# Altium project IR_SCOOTER.PrjPcb (part 3 of 4)

## Sheet IR_COMMUNICATION.SchDoc: IR_COMMUNICATION
size 420 x 297 mm; Engineer: ALPER KORKMAZ; SheetNumber: 6; SheetTotal: 8; SHEET: 6
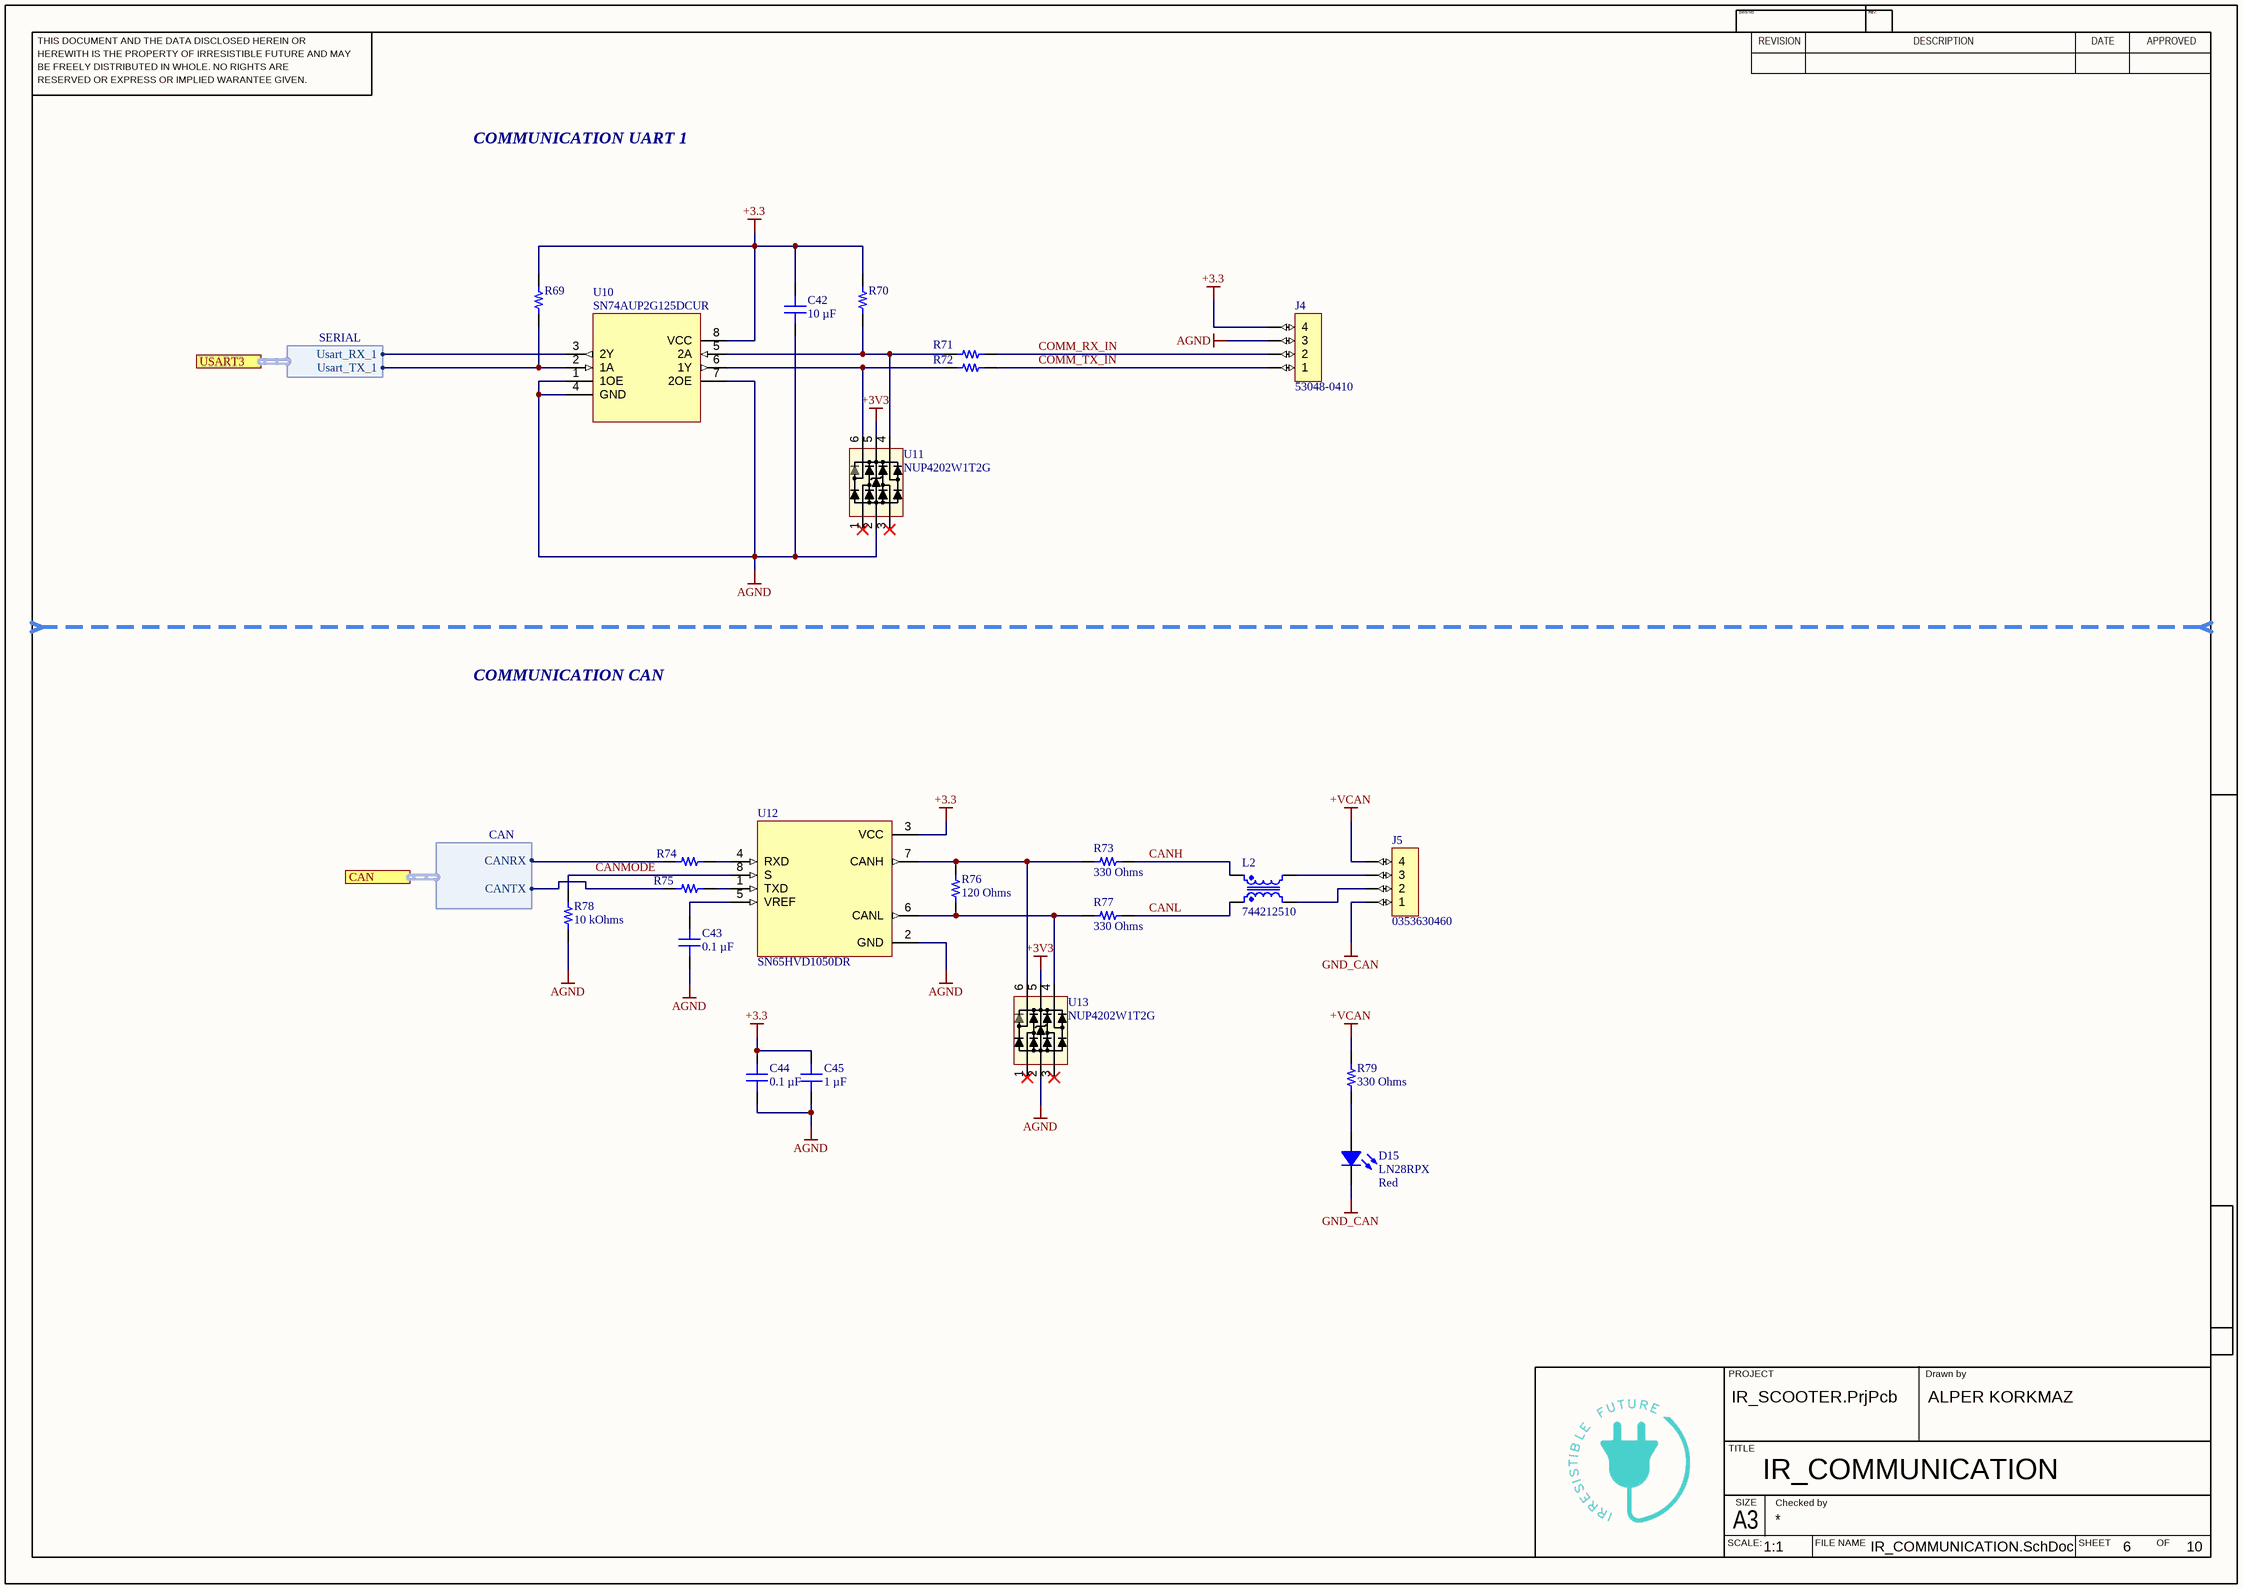
[diagram p5: IR_COMMUNICATION.SchDoc]

### Parts
(Parts that share a designator on the sheet are numbered #1, #2 ... from top to bottom, then left to right.)
C42  10 µF  [CAP 0603_1608]
C43  0.1 µF  [CAP 0603_1608]
C44  0.1 µF  [CAP 0603_1608]
C45  1 µF  [CAP 0603_1608]
D15  LN28RPX  Lens Color: Red  [Led-3mm-Red-h7]
J4#1  53048-0410  [CONN_4_POS__0530480410]
J5#1  0353630460  [CONN_4_POS__0353630460]
L2  744212510  [CM_6.50mm x 3.60mm]
R69  100 kOhms  [RES 0603_1608]  (value not drawn)
R70  100 kOhms  [RES 0603_1608]  (value not drawn)
R71  22 Ohms  [RES 0603_1608]  (value not drawn)
R72  22 Ohms  [RES 0603_1608]  (value not drawn)
R73  330 Ohms  [RES 0603_1608]
R74  22 Ohms  [RES 0603_1608]  (value not drawn)
R75  22 Ohms  [RES 0603_1608]  (value not drawn)
R76  120 Ohms  [RES 0603_1608]
R77  330 Ohms  [RES 0603_1608]
R78  10 kOhms  [RES 0603_1608]
R79  330 Ohms  [RES 0603_1608]
U10  SN74AUP2G125DCUR  [VFSOP_8]
U11  NUP4202W1T2G  [SOT-363]
U12  SN65HVD1050DR  [SOIC-8_L]
U13  NUP4202W1T2G  [SOT-363]

### Ports
CAN (harness CAN, see 1[1B], 3[5B]), USART3 (harness SERIAL, see 1[1B], 3[5B])

### Harnesses
SERIAL: Usart_RX_1, Usart_TX_1
CAN: CANRX, CANTX

### Nets
+3.3: C42.2 C44.2 C45.2 J4#1.4 R69.2 R70.2 U10.8(VCC) U12.3(VCC)
+3V3: U11.5 U13.5
+VCAN: J5#1.4 R79.2
AGND: C42.1 C43.1 C44.1 C45.1 J4#1.3 R78.1 U10.1(1OE) U10.4(GND) U10.7(2OE) U11.2 U12.2(GND) U13.2
GND_CAN: D15.2(K) J5#1.1
CANH: L2.3 R73.2
CANL: L2.1 R77.2
CANMODE: R78.2 U12.8(S)
COMM_RX_IN: J4#1.2 R71.2
COMM_TX_IN: J4#1.1 R72.2
NetC43_2: C43.2 U12.5(VREF)
NetD15_1: D15.1(A) R79.1
NetJ5#1_2: J5#1.2 L2.5
NetJ5#1_3: J5#1.3 L2.4
NetR69_1: R69.1 U10.2(1A) ; port USART3.Usart_TX_1
NetR70_1: R70.1 R71.1 U10.5(2A) U11.4
NetR72_1: R72.1 U10.6(1Y) U11.6
NetR73_1: R73.1 R76.2 U12.7(CANH) U13.6
NetR74_1: R74.1 ; port CAN.CANRX
NetR74_2: R74.2 U12.4(RXD)
NetR75_1: R75.1 ; port CAN.CANTX
NetR75_2: R75.2 U12.1(TXD)
NetR76_1: R76.1 R77.1 U12.6(CANL) U13.4
NetU4_22: U10.3(2Y) ; port USART3.Usart_RX_1

Not connected (* = marked no-connect by the designer): U11 1* 3*; U13 1* 3*

### Notes on the sheet
- COMMUNICATION UART 1
- COMMUNICATION CAN
- THIS DOCUMENT AND THE DATA DISCLOSED HEREIN OR
- HEREWITH IS THE PROPERTY OF IRRESISTIBLE FUTURE AND MAY
- DWG NO:
- REVISION
- REV:
- DESCRIPTION
- DATE
- APPROVED
- BE FREELY DISTRIBUTED IN WHOLE. NO RIGHTS ARE
- RESERVED OR EXPRESS OR IMPLIED WARANTEE GIVEN.
- PROJECT
- Drawn by
- TITLE
- SCALE:
- A3
- SIZE
- Checked by
- FILE NAME
- SHEET
- OF
- 1:1
- 10

### Library data of the parts
C42 = GRM188R60J106ME47D: CAP CER 10UF 6.3V X5R 0603; manufacturer: Murata Electronics; Tolerance: ±20%; Part Number: GRM188R60J106ME47D; Value: 10 µF; Applications: General Purpose; Capacitance: 10 µF; componentlink1description: Datasheet; componentlink1url: https://www.murata.com/~/media/webrenewal/support/library/catalog/products/capacitor/mlcc/c02e.ashx?la=en-us; componentlink2description: DigiKey Link; componentlink2url: https://www.digikey.com/en/products/detail/murata-electronics/GRM188R60J106ME47D/965910; Device Package: 0603 (1608 Metric); lastupdated: 13.07.2022 13:47:07; Lifecycle Status: Active; Minimum Order: 1; Mounting Type: Surface Mount, MLCC; Operating Temperature: -55°C ~ 85°C; Package / Case: 0603 (1608 Metric); packaging: TapeAndReel; partid: 2351; Part Status: Active; price: 0.03; series: GRM; Size / Dimension: 0.063" L x 0.031" W (1.60mm x 0.80mm); Supplier 1: DigiKey; Supplier Part Number 1: 490-3896-1-ND; Temperature Coefficient: X5R; Thickness (Max): 0.035" (0.90mm); Voltage - Rated: 6.3V
C43 C44 = C0603C104K5RECAUTO: CAP CER 0.10UF 50V X7R 0603; manufacturer: KEMET; Tolerance: ±10%; Part Number: C0603C104K5RECAUTO; Value: 0.1 µF; Applications: Automotive, ESD Protection; Capacitance: 0.1 µF; componentlink1description: Datasheet; componentlink1url: https://api.kemet.com/component-edge/download/datasheet/C0603C104K5RECAUTO.pdf; componentlink2description: DigiKey Link; componentlink2url: https://www.digikey.com/en/products/detail/kemet/C0603C104K5RECAUTO/6575893; Device Package: 0603 (1608 Metric); lastupdated: 13.07.2022 13:46:58; Lifecycle Status: Active; Minimum Order: 1; Mounting Type: Surface Mount, MLCC; Operating Temperature: -55°C ~ 125°C; Package / Case: 0603 (1608 Metric); packaging: TapeAndReel; partid: 6683; Part Status: Active; price: 0.04; Ratings: AEC-Q200; series: ESD SMD Auto X7R; Size / Dimension: 0.063" L x 0.031" W (1.60mm x 0.80mm); Supplier 1: DigiKey; Supplier Part Number 1: 399-14105-1-ND; Temperature Coefficient: X7R; Thickness (Max): 0.034" (0.87mm); Voltage - Rated: 50V
C45 = C0603C105K4RACAUTO: CAP CER 1UF 16V X7R 0603; manufacturer: KEMET; Tolerance: ±10%; Part Number: C0603C105K4RACAUTO; Value: 1 µF; Applications: Automotive, Bypass, Decoupling; Capacitance: 1 µF; componentlink1description: Datasheet; componentlink1url: https://api.kemet.com/component-edge/download/datasheet/C0603C105K4RACAUTO.pdf; componentlink2description: DigiKey Link; componentlink2url: https://www.digikey.com/en/products/detail/kemet/C0603C105K4RACAUTO/8635831; Device Package: 0603 (1608 Metric); lastupdated: 13.07.2022 13:47:07; Lifecycle Status: Active; Minimum Order: 1; Mounting Type: Surface Mount, MLCC; Operating Temperature: -55°C ~ 125°C; Package / Case: 0603 (1608 Metric); packaging: TapeAndReel; partid: 2179; Part Status: Active; price: 0.02; Ratings: AEC-Q200; series: SMD Auto X7R; Size / Dimension: 0.063" L x 0.031" W (1.60mm x 0.80mm); Supplier 1: DigiKey; Supplier Part Number 1: 399-17704-1-ND; Temperature Coefficient: X7R; Thickness (Max): 0.037" (0.95mm); Voltage - Rated: 16V
D15 = LED_RED__LN28RPX: LED RED DIFF 3MM ROUND T/H; Manufacturer: Panasonic Electronic Components; Lens Transparency: Diffused; Millicandela Rating: 2.8mcd; Lens Style/Size: Round with Domed Top, 3mm (T-1), 3.00mm; Voltage - Forward (Vf) (Typ): 2.2V; Current - Test: 15mA; Wavelength - Peak: 700nm; Manufacturer Part Number: LN28RPX; Category: Optoelectronics; Supplier: Digi-Key; RoHS: RoHS Compliant; Packaging: Bulk; Part Status: Not For New Designs; Color: Red; Viewing Angle: -; Mounting Type: Through Hole; Wavelength - Dominant: -; Features: -; Package / Case: Radial; Supplier Device Package: 3mm Round; Size / Dimension: -; Height (Max): 5.70mm; ComponentLink1URL: http://industrial.panasonic.com/www-cgi/jvcr13pz.cgi?E+SC+4+ATA7001+LN28RPX+8+WW; ComponentLink1Description: http://industrial.panasonic.com/www-cgi/jvcr13pz.cgi?E+SC+4+ATA7001+LN28RPX+8+WW; Pricing: 1=0.45, 10=0.326, 25=0.2664, 100=0.213, 250=0.17972, 500=0.15308, 1000=0.11981, 2500=0.10982, 5000=0.09984 (USD); Supplier Part Number: P563-ND
J4#1 = CONN_4_POS__0530480410: CONN HEADER R/A 4POS 1.25MM; Manufacturer: Molex; Contact Resistance: 20mR; Current Rating: 1A; Voltage Rating: 125V; Number of Positions: 4; Insulation Resistance: 100MR; Gender: Male; Connector Type: Blade Pin; Glow Wire Compliant: Non-compliant; Supplier 1: Avnet; Manufacturer Part Number: 53048-0410; Stock 1: 44; Pricing 1: 1=0.1232 (USD); Mount: Through Hole; Case/Package: 0410; Contact Material: Bronze,Tin; Contact Plating: Tin; Color: Natural; Housing Color: Natural; Housing Material: Nylon; Min Operating Temperature: -40°C; Max Operating Temperature: 85°C; Package Quantity: 5000; Number of Rows: 1; Packaging: Tray; Contact Gender: Male; Termination: Solder; Number of Contacts: 4; Orientation: Right Angle; Number of Circuits: 4; Voltage Rating (DC): 125V; Series: PicoBlade; Contact Type: Blade Pin; Pitch: 1.25mm; Depth: 5.5mm; Radiation Hardening: No; REACH SVHC: Unknown; Lead Free: Lead Free; Flammability Rating: UL94 V-0; RoHS Compliant: Yes; ComponentLink1URL: https://www.distrelec.biz/Web/Downloads/60/_e/gg116847-116860_e.pdf?mime=application%2Fpdf&src-supplier=Distrelec; ComponentLink1Description: https://www.distrelec.biz/Web/Downloads/60/_e/gg116847-116860_e.pdf?mime=application%2Fpdf&src-supplier=Distrelec; ComponentLink2URL: http://uk.rs-online.com/webdocs/1362/0900766b81362ba7.pdf?src-supplier=RSComponents; ComponentLink2Description: http://uk.rs-online.com/webdocs/1362/0900766b81362ba7.pdf?src-supplier=RSComponents; ComponentLink3URL: http://www.molex.com/webdocs/datasheets/pdf/en-us/0530480410_PCB_HEADERS.pdf?src-supplier=Avnet; ComponentLink3Description: http://www.molex.com/webdocs/datasheets/pdf/en-us/0530480410_PCB_HEADERS.pdf?src-supplier=Avnet; ComponentLink4URL: http://www.mouser.com/ds/2/276/0530480410_PCB_HEADERS-170930.pdf?src-supplier=Mouser; ComponentLink4Description: http://www.mouser.com/ds/2/276/0530480410_PCB_HEADERS-170930.pdf?src-supplier=Mouser; Supplier Part Number 1: 53048-0410
J5#1 = CONN_4_POS__0353630460: CONN HEADER 4POS 2MM R/A TIN; Manufacturer: Molex Connector Corporation; Shrouding: Shrouded - 4 Wall; Style: Board to Cable/Wire; Pitch - Mating: 0.079" (2.00mm); Material Flammability Rating: UL94 V-0; Contact Length - Mating: 0.145" (3.70mm); Contact Length - Post: 0.126" (3.20mm); Number of Positions Loaded: All; Number of Positions: 4; Insulation Color: Natural; Insulation Material: Polyamide (PA), Nylon; Contact Finish Thickness - Mating: 78.7µin (2.00µm); Insulation Height: 0.217" (5.51mm); Overall Contact Length: -; Part Status: Active; Current Rating: -; RoHS: RoHS Compliant; Ingress Protection: -; Contact Material: Brass; Contact Finish - Post: Tin; Termination: Kinked Pin, Solder; Mounting Type: Through Hole, Right Angle; Fastening Type: Locking Ramp; Row Spacing - Mating: -; Mated Stacking Heights: -; Features: -; Contact Shape: Square; Contact Type: Male Pin; Packaging: Bulk; Supplier: Digi-Key; Manufacturer Part Number: 0353630460; Category: Connectors, Interconnects; Contact Finish Thickness - Post: 78.7µin (2.00µm); Voltage Rating: -; Operating Temperature: -; Contact Finish - Mating: Tin; Number of Rows: 1; Connector Type: Header; Applications: Automotive, General Purpose; ComponentLink1URL: http://www.molex.com/pdm_docs/sd/353630460_sd.pdf; ComponentLink1Description: http://www.molex.com/pdm_docs/sd/353630460_sd.pdf; Pricing: 1=0.48, 10=0.455, 100=0.3184, 500=0.27294, 1000=0.22745, 5000=0.19496, 10000=0.18196 (USD); Supplier Part Number: WM18933-ND
L2 = CM__744212510: Common Mode Filters / Chokes WE-SL1 SMD Ln Filter 2x51uH 300ohm; Manufacturer: Wurth Electronics; Core Material: Ferrite; Inductance: 51uH; Number of Lines: 2; DC Resistance (DCR): 160mR; Current Rating: 300mA; Test Frequency: 100kHz; Inductance Tolerance: 50%; Voltage Rating (DC): 80V; Impedance: 300R; Supplier 1: Digi-Key; Manufacturer Part Number: 744212510; RoHS: Yes; Category: Fixed Inductors; Pricing 1: 1=4,37000, 10=4,31200, 50=3,89500, 100=3,75600, 500=3,47800 (USD); Mount: Surface Mount; Case/Package: SMD/SMT; Number of Pins: 4; Min Operating Temperature: -40°C; Max Operating Temperature: 105°C; Package Quantity: 1000; Packaging: Tape and Reel; Current: 300mA; Max DC Current: 300mA; Termination: SMD/SMT; Series: WE-SL1; Tolerance: 50%; Length: 6.5mm; Width: 0.142inch; Height: 1.65mm; Depth: 3.6mm; REACH SVHC: No SVHC; Lead Free: Lead Free; RoHS Compliant: Yes; ComponentLink1URL: https://datasheet.ciiva.com/11800/0900766b8059564e-11800467.pdf?src-supplier=RSComponents; ComponentLink1Description: https://datasheet.ciiva.com/11800/0900766b8059564e-11800467.pdf?src-supplier=RSComponents; ComponentLink2URL: https://datasheet.ciiva.com/6048/1735560-6048484.pdf?src-supplier=Farnell; ComponentLink2Description: https://datasheet.ciiva.com/6048/1735560-6048484.pdf?src-supplier=Farnell; ComponentLink3URL: https://datasheet.ciiva.com/1130/744212510-1130407.pdf?src-supplier=Newark; ComponentLink3Description: https://datasheet.ciiva.com/1130/744212510-1130407.pdf?src-supplier=Newark; ComponentLink4URL: https://datasheet.ciiva.com/4952/744212510-77598-4952687.pdf?src-supplier=Mouser; ComponentLink4Description: https://datasheet.ciiva.com/4952/744212510-77598-4952687.pdf?src-supplier=Mouser; ComponentLink5URL: https://datasheet.ciiva.com/7764/1735560-7764951.pdf?src-supplier=Element14; ComponentLink5Description: https://datasheet.ciiva.com/7764/1735560-7764951.pdf?src-supplier=Element14; ComponentLink6URL: https://datasheet.ciiva.com/6216/744212510-6216346.pdf?src-supplier=Digi-Key; ComponentLink6Description: https://datasheet.ciiva.com/6216/744212510-6216346.pdf?src-supplier=Digi-Key; ComponentLink7URL: https://datasheet.ciiva.com/22705/1735560-22705131.pdf?src-supplier=Element14; ComponentLink7Description: https://datasheet.ciiva.com/22705/1735560-22705131.pdf?src-supplier=Element14; ComponentLink8URL: https://datasheet.ciiva.com/6216/744212510-6216348.pdf?src-supplier=Digi-Key; ComponentLink8Description: https://datasheet.ciiva.com/6216/744212510-6216348.pdf?src-supplier=Digi-Key; Supplier Part Number 1: 732-3941-6-ND
R69 R70 = RNCS0603BKE100K: RES 100K OHM 0.1% 1/16W 0603; Manufacturer: Stackpole Electronics Inc; Power (Watts): 0.063W, 1/16W; Temperature Coefficient: ±25ppm/°C; Part Number: RNCS0603BKE100K; Value: 100 kOhms; ComponentLink1Description: Datasheet; ComponentLink1URL: https://www.seielect.com/catalog/sei-rncs_rnch.pdf; ComponentLink2Description: DigiKey Link; ComponentLink2URL: https://www.digikey.com/en/products/detail/stackpole-electronics-inc/RNCS0603BKE100K/1708835; Composition: Thin Film; Device Package: 0603 (1608 Metric); Features: Anti-Corrosive, Automotive AEC-Q200, Moisture Resistant; Height - Seated (Max): 0.022" (0.55mm); LastUpdated: 13.07.2022 14:08:49; Lifecycle Status: Active; Minimum Order: 1; Number of Terminations: 2; Operating Temperature: -55°C ~ 155°C; Package / Case: 0603 (1608 Metric); Packaging: TapeAndReel; PartId: 4849; Part Status: Active; Price: 0.08; Ratings: AEC-Q200; Resistance: 100 kOhms; Series: RNCS; Size / Dimension: 0.061" L x 0.031" W (1.55mm x 0.80mm); Supplier 1: DigiKey; Supplier Part Number 1: RNCS0603BKE100KCT-ND; Supplier Device Package: 0603; Tolerance: ±0.1%
R71 R72 R74 R75 = ERJ-3EKF22R0V: RES SMD 22 OHM 1% 1/10W 0603; Manufacturer: Panasonic Electronic Components; Power (Watts): 0.1W, 1/10W; Temperature Coefficient: ±100ppm/°C; Part Number: ERJ-3EKF22R0V; Value: 22 Ohms; ComponentLink1Description: Datasheet; ComponentLink1URL: https://industrial.panasonic.com/cdbs/www-data/pdf/RDA0000/AOA0000C304.pdf; ComponentLink2Description: DigiKey Link; ComponentLink2URL: https://www.digikey.com/en/products/detail/panasonic-electronic-components/ERJ-3EKF22R0V/1746340; Composition: Thick Film; Device Package: 0603 (1608 Metric); Features: Automotive AEC-Q200; Height - Seated (Max): 0.022" (0.55mm); LastUpdated: 13.07.2022 14:08:47; Lifecycle Status: Active; Minimum Order: 1; Number of Terminations: 2; Operating Temperature: -55°C ~ 155°C; Package / Case: 0603 (1608 Metric); Packaging: TapeAndReel; PartId: 5655; Part Status: Active; Price: 0.01; Ratings: AEC-Q200; Resistance: 22 Ohms; Series: ERJ-3EK; Size / Dimension: 0.063" L x 0.031" W (1.60mm x 0.80mm); Supplier 1: DigiKey; Supplier Part Number 1: P22.0HCT-ND; Supplier Device Package: 0603; Tolerance: ±1%
R73 R77 R79 = CRGH0603F330R: RES SMD 330 OHM 1% 1/5W 0603; Manufacturer: TE Connectivity Passive Product; Power (Watts): 0.2W, 1/5W; Temperature Coefficient: ±100ppm/°C; Part Number: CRGH0603F330R; Value: 330 Ohms; ComponentLink1Description: Datasheet; ComponentLink1URL: https://www.te.com/commerce/DocumentDelivery/DDEController?Action=srchrtrv&DocNm=1773204-1&DocType=DS&DocLang=English; ComponentLink2Description: DigiKey Link; ComponentLink2URL: https://www.digikey.com/en/products/detail/te-connectivity-passive-product/CRGH0603F330R/5586961; Composition: Thick Film; Device Package: 0603 (1608 Metric); Height - Seated (Max): 0.022" (0.55mm); LastUpdated: 13.07.2022 14:08:46; Lifecycle Status: Active; Minimum Order: 1; Number of Terminations: 2; Operating Temperature: -55°C ~ 155°C; Package / Case: 0603 (1608 Metric); Packaging: TapeAndReel; PartId: 5733; Part Status: Active; Price: 0.01; Resistance: 330 Ohms; Series: CRGH, Neohm; Size / Dimension: 0.063" L x 0.031" W (1.60mm x 0.80mm); Supplier 1: DigiKey; Supplier Part Number 1: A129541CT-ND; Supplier Device Package: 0603; Tolerance: ±1%
R76 = RMCF0603JT120R: RES 120 OHM 5% 1/10W 0603; Manufacturer: Stackpole Electronics Inc; Power (Watts): 0.1W, 1/10W; Temperature Coefficient: ±200ppm/°C; Part Number: RMCF0603JT120R; Value: 120 Ohms; ComponentLink1Description: Datasheet; ComponentLink1URL: https://www.seielect.com/catalog/sei-rmcf_rmcp.pdf; ComponentLink2Description: DigiKey Link; ComponentLink2URL: https://www.digikey.com/en/products/detail/stackpole-electronics-inc/RMCF0603JT120R/1757978; Composition: Thick Film; Device Package: 0603 (1608 Metric); Features: Automotive AEC-Q200; Height - Seated (Max): 0.022" (0.55mm); LastUpdated: 13.07.2022 14:08:46; Lifecycle Status: Active; Minimum Order: 1; Number of Terminations: 2; Operating Temperature: -55°C ~ 155°C; Package / Case: 0603 (1608 Metric); Packaging: CutTape; PartId: 5957; Part Status: Active; Price: 0.01; Ratings: AEC-Q200; Resistance: 120 Ohms; Series: RMCF; Size / Dimension: 0.061" L x 0.031" W (1.55mm x 0.80mm); Supplier 1: DigiKey; Supplier Part Number 1: RMCF0603JT120RCT-ND; Supplier Device Package: 0603; Tolerance: ±5%
R78 = RNCS0603BKE10K0: RES 10K OHM 0.1% 1/16W 0603; Manufacturer: Stackpole Electronics Inc; Power (Watts): 0.063W, 1/16W; Temperature Coefficient: ±25ppm/°C; Part Number: RNCS0603BKE10K0; Value: 10 kOhms; ComponentLink1Description: Datasheet; ComponentLink1URL: https://www.seielect.com/catalog/sei-rncs_rnch.pdf; ComponentLink2Description: DigiKey Link; ComponentLink2URL: https://www.digikey.com/en/products/detail/stackpole-electronics-inc/RNCS0603BKE10K0/1708836; Composition: Thin Film; Device Package: 0603 (1608 Metric); Features: Anti-Corrosive, Automotive AEC-Q200, Moisture Resistant; Height - Seated (Max): 0.022" (0.55mm); LastUpdated: 13.07.2022 14:08:49; Lifecycle Status: Active; Minimum Order: 1; Number of Terminations: 2; Operating Temperature: -55°C ~ 155°C; Package / Case: 0603 (1608 Metric); Packaging: TapeAndReel; PartId: 4838; Part Status: Active; Price: 0.08; Ratings: AEC-Q200; Resistance: 10 kOhms; Series: RNCS; Size / Dimension: 0.061" L x 0.031" W (1.55mm x 0.80mm); Supplier 1: DigiKey; Supplier Part Number 1: RNCS0603BKE10K0CT-ND; Supplier Device Package: 0603; Tolerance: ±0.1%
U10 = SN74AUP2G125DCUR: Low-Power Dual Bus Buffer Gate With 3-State Outputs 8-VSSOP -40 to 85; Manufacturer: Texas Instruments; Max Supply Voltage: 3.6V; Min Supply Voltage: 800mV; Propagation Delay: 6.5ns; Number of Elements: 2; Logic Function: Buffer,Inverting; Low Level Output Current: 4mA; Number of Input Lines: 4; Polarity: Non-Inverting; Number of Bits per Element: 1; High Level Output Current: -4mA; Quiescent Current: 500nA; Supplier 1: Avnet; Manufacturer Part Number: SN74AUP2G125DCUR; Stock 1: 0; Mount: Surface Mount; Case/Package: VSSOP; Number of Pins: 8; Min Operating Temperature: -40°C; Max Operating Temperature: 85°C; Package Quantity: 3000; Packaging: Tape and Reel; Number of Channels: 2; Number of Inputs: 2; Number of Outputs: 2; Number of Output Lines: 4; Number of Bits: 2; Output Type: 3-STATE; Series: 74AUP; Technology: CMOS; Lead Free: Lead Free; RoHS Compliant: Yes; ComponentLink1URL: http://www.ti.com/lit/ds/symlink/sn74aup2g125.pdf?src-supplier=Digi-Key; ComponentLink1Description: http://www.ti.com/lit/ds/symlink/sn74aup2g125.pdf?src-supplier=Digi-Key; ComponentLink2URL: http://www.ti.com/general/docs/lit/getliterature.tsp?genericPartNumber=SN74AUP2G125&&fileType=pdf&src-supplier=Avnet; ComponentLink2Description: http://www.ti.com/general/docs/lit/getliterature.tsp?genericPartNumber=SN74AUP2G125&&fileType=pdf&src-supplier=Avnet; Supplier Part Number 1: SN74AUP2G125DCUR
U11 U13 = NUP4202W1T2G: TVS DIODE 5VWM 14.5VC SOT363; Manufacturer: ON Semiconductor; Capacitance @ Frequency: 3pF @ 1MHz; Voltage - Reverse Standoff (Typ): 5V (Max); Voltage - Breakdown (Min): 6V; Power Line Protection: No; Current - Peak Pulse (10/1000µs): 28A (8/20µs); Power - Peak Pulse: 500W; Voltage - Clamping (Max) @ Ipp: 14.5V (Typ); Type: Steering (Rail to Rail); Operating Temperature: -40°C ~ 125°C (TJ); Supplier: Digi-Key; Applications: General Purpose; Manufacturer Part Number: NUP4202W1T2G; Packaging: Cut Tape (CT); Package / Case: 6-TSSOP, SC-88, SOT-363; Mounting Type: Surface Mount; RoHS: RoHS Compliant; Category: Circuit Protection; Supplier Device Package: SC-88/SC70-6/SOT-363; Part Status: Active; ComponentLink1URL: http://www.onsemi.com/pub_link/Collateral/NUP4202W1-D.PDF; ComponentLink1Description: http://www.onsemi.com/pub_link/Collateral/NUP4202W1-D.PDF; Pricing: 1=0.69, 10=0.595, 100=0.4441, 500=0.34896, 1000=0.26965 (USD); Stock: 8683; Supplier Part Number: NUP4202W1T2GOSCT-ND
U12 = SN65HVD1050DR: High-Speed CAN Transceiver with Silent Mode 8-SOIC -40 to 125; MF: Texas Instruments; Min Supply Voltage: 4.75V; Max Supply Voltage: 5.25V; Data Rate: 1Mbps; Number of Transceivers: 1; Operating Supply Voltage: 5V; Nominal Supply Current: 70mA; Purchase-URL: https://pricing.snapeda.com/search/part/SN65HVD1050DR/?ref=eda; Digi-Key_Part_Number: 296-26335-1-ND; MP: SN65HVD1050DR; Check_prices: https://www.snapeda.com/parts/SN65HVD1050DR/Texas%20Instruments/view-part/1043210/?ref=eda; SnapEDA_Link: https://www.snapeda.com/parts/SN65HVD1050DR/Texas%20Instruments/view-part/1043210/?ref=snap; Value: *; Package: SOIC-8 Texas Instruments; Supplier 1: Digi-Key; Manufacturer: Texas Instruments; Manufacturer Part Number: SN65HVD1050DR; RoHS: Yes; Category: Interface ICs; Pricing 1: 1=1,69000, 10=1,51300, 25=1,43640, 100=1,18000, 250=1,10304, 500=0,97478, 1000=0,84700 (USD); Case/Package: D; Number of Pins: 8; Weight: 0.002677oz; Contact Plating: Gold; Min Operating Temperature: -40°C; Max Operating Temperature: 125°C; Packaging: Tape and Reel; Package Quantity: 2500; Max Supply Current: 70mA; Number of Drivers: 1; Number of Receivers: 1; Series: -; Supply Current: 70mA; Number of Transmit Buffers: 1; Number of Receive Buffers: 1; Radiation Hardening: No; Lead Free: Lead Free; RoHS Compliant: Yes; REACH SVHC: No SVHC; ComponentLink1URL: https://datasheet.ciiva.com/26828/sn65hvd1050dr-26828644.pdf?src-supplier=IIIC; ComponentLink1Description: https://datasheet.ciiva.com/26828/sn65hvd1050dr-26828644.pdf?src-supplier=IIIC; ComponentLink2URL: https://datasheet.ciiva.com/46392/1888948-46392549.pdf?src-supplier=Element14; ComponentLink2Description: https://datasheet.ciiva.com/46392/1888948-46392549.pdf?src-supplier=Element14; ComponentLink3URL: https://datasheet.ciiva.com/1701/sn65hvd1050-1701693.pdf?src-supplier=Digi-Key; ComponentLink3Description: https://datasheet.ciiva.com/1701/sn65hvd1050-1701693.pdf?src-supplier=Digi-Key; ComponentLink4URL: https://datasheet.ciiva.com/1701/sn65hvd1050-1701694.pdf?src-supplier=Digi-Key; ComponentLink4Description: https://datasheet.ciiva.com/1701/sn65hvd1050-1701694.pdf?src-supplier=Digi-Key; ComponentLink5URL: https://datasheet.ciiva.com/1701/sn65hvd1050-1701695.pdf?src-supplier=Digi-Key; ComponentLink5Description: https://datasheet.ciiva.com/1701/sn65hvd1050-1701695.pdf?src-supplier=Digi-Key; Supplier Part Number 1: 296-26335-6-ND

## Sheet IR_GATE_DRIVER_1.SchDoc: IR_GATE_DRIVER_1
size 420 x 297 mm; Engineer: ALPER KORKMAZ; SheetNumber: 5; SheetTotal: 8; SHEET: 5
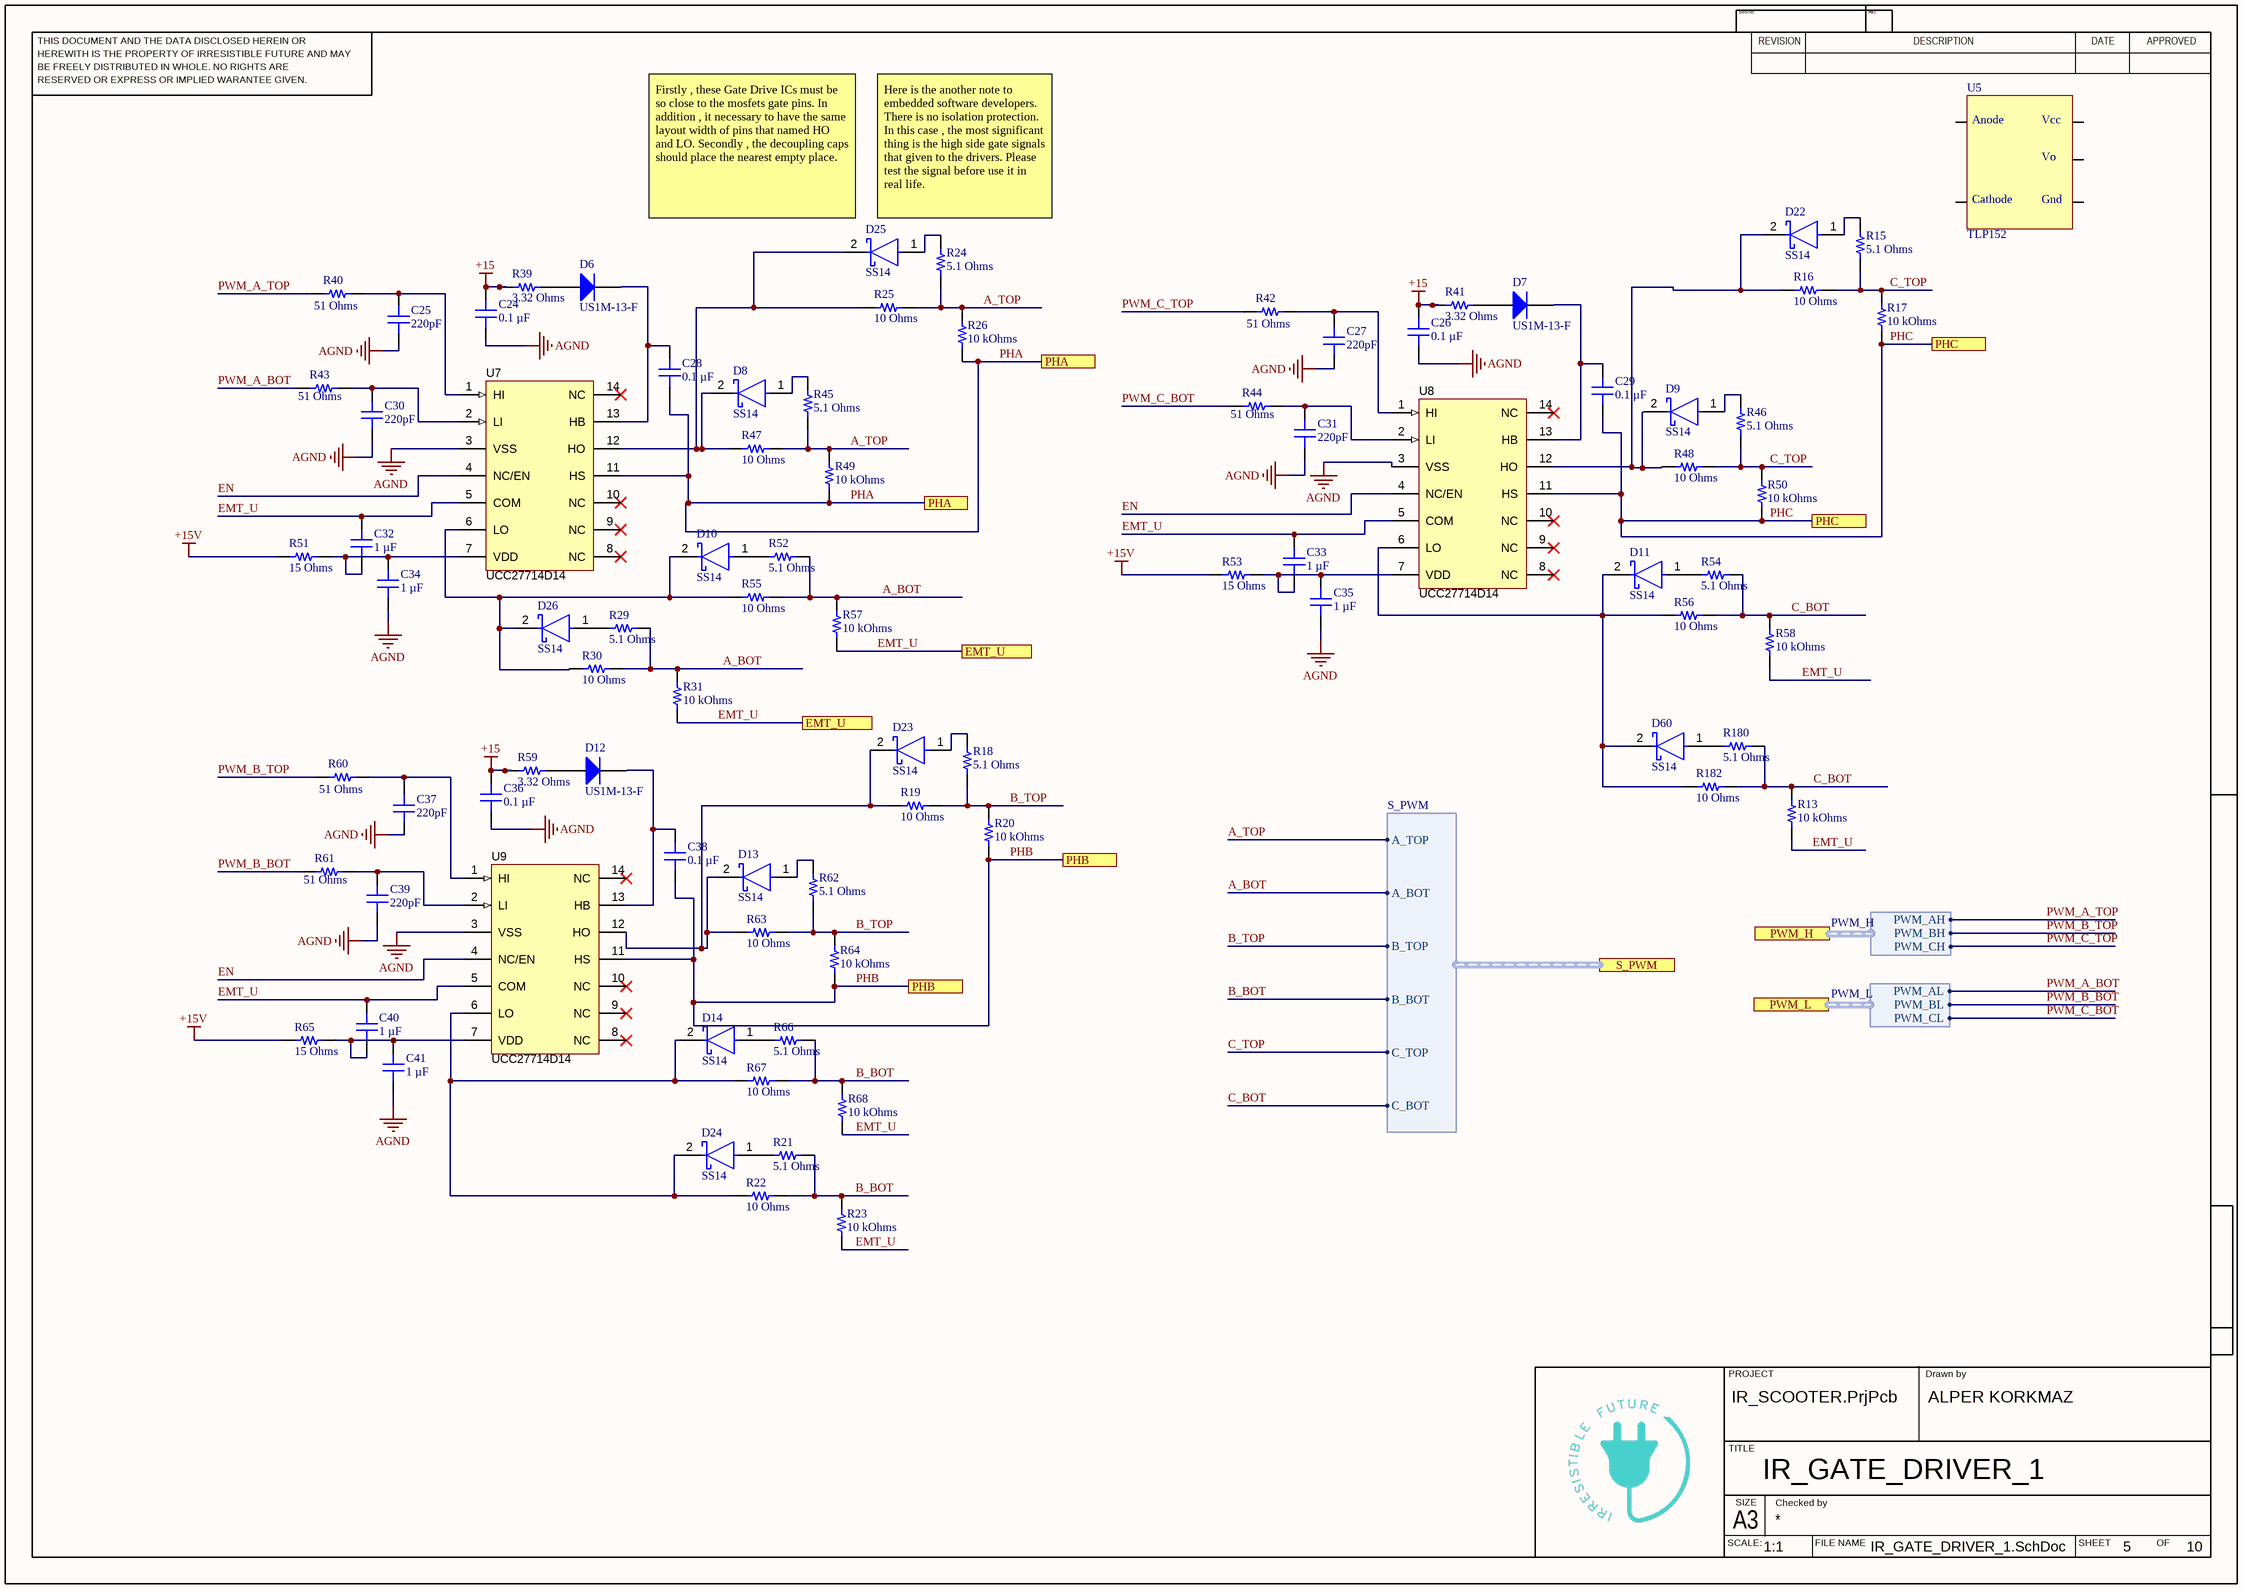
[diagram p6: IR_GATE_DRIVER_1.SchDoc]

### Parts
C24  0.1 µF  [CAP 0603_1608]
C25  220pF  [CAP 0603_1608]
C26  0.1 µF  [CAP 0603_1608]
C27  220pF  [CAP 0603_1608]
C28  0.1 µF  [CAP 0603_1608]
C29  0.1 µF  [CAP 0603_1608]
C30  220pF  [CAP 0603_1608]
C31  220pF  [CAP 0603_1608]
C32  1 µF  [CAP 0603_1608]
C33  1 µF  [CAP 0603_1608]
C34  1 µF  [CAP 0603_1608]
C35  1 µF  [CAP 0603_1608]
C36  0.1 µF  [CAP 0603_1608]
C37  220pF  [CAP 0603_1608]
C38  0.1 µF  [CAP 0603_1608]
C39  220pF  [CAP 0603_1608]
C40  1 µF  [CAP 0603_1608]
C41  1 µF  [CAP 0603_1608]
D6  US1M-13-F  [DIOD-SMA-2_A_V]
D7  US1M-13-F  [DIOD-SMA-2_A_V]
D8  SS14  [FP-403AE-MFG]
D9  SS14  [FP-403AE-MFG]
D10  SS14  [FP-403AE-MFG]
D11  SS14  [FP-403AE-MFG]
D12  US1M-13-F  [DIOD-SMA-2_A_V]
D13  SS14  [FP-403AE-MFG]
D14  SS14  [FP-403AE-MFG]
D22  SS14  [FP-403AE-MFG]
D23  SS14  [FP-403AE-MFG]
D24  SS14  [FP-403AE-MFG]
D25  SS14  [FP-403AE-MFG]
D26  SS14  [FP-403AE-MFG]
D60  SS14  [FP-403AE-MFG]
R13  10 kOhms  [RES 0603_1608]
R15  5.1 Ohms  [RES 0603_1608]
R16  10 Ohms  [RES 0603_1608]
R17  10 kOhms  [RES 0603_1608]
R18  5.1 Ohms  [RES 0603_1608]
R19  10 Ohms  [RES 0603_1608]
R20  10 kOhms  [RES 0603_1608]
R21  5.1 Ohms  [RES 0603_1608]
R22  10 Ohms  [RES 0603_1608]
R23  10 kOhms  [RES 0603_1608]
R24  5.1 Ohms  [RES 0603_1608]
R25  10 Ohms  [RES 0603_1608]
R26  10 kOhms  [RES 0603_1608]
R29  5.1 Ohms  [RES 0603_1608]
R30  10 Ohms  [RES 0603_1608]
R31  10 kOhms  [RES 0603_1608]
R39  3.32 Ohms  [RES 0603_1608]
R40  51 Ohms  [RES 0603_1608]
R41  3.32 Ohms  [RES 0603_1608]
R42  51 Ohms  [RES 0603_1608]
R43  51 Ohms  [RES 0603_1608]
R44  51 Ohms  [RES 0603_1608]
R45  5.1 Ohms  [RES 0603_1608]
R46  5.1 Ohms  [RES 0603_1608]
R47  10 Ohms  [RES 0603_1608]
R48  10 Ohms  [RES 0603_1608]
R49  10 kOhms  [RES 0603_1608]
R50  10 kOhms  [RES 0603_1608]
R51  15 Ohms  [RES 0603_1608]
R52  5.1 Ohms  [RES 0603_1608]
R53  15 Ohms  [RES 0603_1608]
R54  5.1 Ohms  [RES 0603_1608]
R55  10 Ohms  [RES 0603_1608]
R56  10 Ohms  [RES 0603_1608]
R57  10 kOhms  [RES 0603_1608]
R58  10 kOhms  [RES 0603_1608]
R59  3.32 Ohms  [RES 0603_1608]
R60  51 Ohms  [RES 0603_1608]
R61  51 Ohms  [RES 0603_1608]
R62  5.1 Ohms  [RES 0603_1608]
R63  10 Ohms  [RES 0603_1608]
R64  10 kOhms  [RES 0603_1608]
R65  15 Ohms  [RES 0603_1608]
R66  5.1 Ohms  [RES 0603_1608]
R67  10 Ohms  [RES 0603_1608]
R68  10 kOhms  [RES 0603_1608]
R180  5.1 Ohms  [RES 0603_1608]
R182  10 Ohms  [RES 0603_1608]
U5  TLP152  [TLP152]
U7  UCC27714D14  [D0014A_N]
U8  UCC27714D14  [D0014A_N]
U9  UCC27714D14  [D0014A_N]

### Ports
EMT_U (see 1[3A], 4[3D]), PHA (see 1[3A], 4[2B]), PHB (see 1[3A], 4[2C]), PHC (see 1[3A], 4[4B]), PWM_H (harness PWM_H, see 1[2A], 3[2B]), PWM_L (harness PWM_L, see 1[2A], 3[2B]), S_PWM (harness S_PWM, see 1[3A], 4[6C])

### Harnesses
S_PWM: A_TOP, A_BOT, B_TOP, B_BOT, C_TOP, C_BOT
PWM_H: PWM_CH, PWM_BH, PWM_AH
PWM_L: PWM_CL, PWM_BL, PWM_AL

### Nets
+15: C24.2 C26.2 C36.2 R39.1 R41.1 R59.1
+15V: R51.1 R53.1 R65.1
AGND: C24.1 C25.1 C26.1 C27.1 C30.1 C31.1 C34.1 C35.1 C36.1 C37.1 C39.1 C41.1 U7.3(VSS) U8.3(VSS) U9.3(VSS)
A_BOT: R29.2 R30.2 R31.2 R52.2 R55.2 R57.2 ; port S_PWM.A_BOT
A_TOP: R24.2 R25.2 R26.2 R45.2 R47.2 R49.2 ; port S_PWM.A_TOP
B_BOT: R21.2 R22.2 R23.2 R66.2 R67.2 R68.2 ; port S_PWM.B_BOT
B_TOP: R18.2 R19.2 R20.2 R62.2 R63.2 R64.2 ; port S_PWM.B_TOP
C_BOT: R13.2 R54.2 R56.2 R58.2 R180.2 R182.2 ; port S_PWM.C_BOT
C_TOP: R15.2 R16.2 R17.2 R46.2 R48.2 R50.2 ; port S_PWM.C_TOP
EMT_U: C32.2 C33.2 C40.2 R13.1 R23.1 R31.1 R57.1 R58.1 R68.1 U7.5(COM) U8.5(COM) U9.5(COM) ; port EMT_U
EN: U7.4(NC/EN) U8.4(NC/EN) U9.4(NC/EN)
PHA: C28.1 R26.1 R49.1 U7.11(HS) ; port PHA
PHB: C38.1 R20.1 R64.1 U9.11(HS) ; port PHB
PHC: C29.1 R17.1 R50.1 U8.11(HS) ; port PHC
PWM_A_BOT: R43.1 ; port PWM_L.PWM_AL
PWM_A_TOP: R40.1 ; port PWM_H.PWM_AH
PWM_B_BOT: R61.1 ; port PWM_L.PWM_BL
PWM_B_TOP: R60.1 ; port PWM_H.PWM_BH
PWM_C_BOT: R44.1 ; port PWM_L.PWM_CL
PWM_C_TOP: R42.1 ; port PWM_H.PWM_CH
NetC25_2: C25.2 R40.2 U7.1(HI)
NetC27_2: C27.2 R42.2 U8.1(HI)
NetC28_2: C28.2 D6.2(K) U7.13(HB)
NetC29_2: C29.2 D7.2(K) U8.13(HB)
NetC30_2: C30.2 R43.2 U7.2(LI)
NetC31_2: C31.2 R44.2 U8.2(LI)
NetC32_1: C32.1 C34.2 R51.2 U7.7(VDD)
NetC33_1: C33.1 C35.2 R53.2 U8.7(VDD)
NetC37_2: C37.2 R60.2 U9.1(HI)
NetC38_2: C38.2 D12.2(K) U9.13(HB)
NetC39_2: C39.2 R61.2 U9.2(LI)
NetC40_1: C40.1 C41.2 R65.2 U9.7(VDD)
NetD6_1: D6.1(A) R39.2
NetD7_1: D7.1(A) R41.2
NetD8_1: D8.1(A) R45.1
NetD8_2: D8.2(C) D25.2(C) R25.1 R47.1 U7.12(HO)
NetD9_1: D9.1(A) R46.1
NetD9_2: D9.2(C) D22.2(C) R16.1 R48.1 U8.12(HO)
NetD10_1: D10.1(A) R52.1
NetD10_2: D10.2(C) D26.2(C) R30.1 R55.1 U7.6(LO)
NetD11_1: D11.1(A) R54.1
NetD11_2: D11.2(C) D60.2(C) R56.1 R182.1 U8.6(LO)
NetD12_1: D12.1(A) R59.2
NetD13_1: D13.1(A) R62.1
NetD13_2: D13.2(C) D23.2(C) R19.1 R63.1 U9.12(HO)
NetD14_1: D14.1(A) R66.1
NetD14_2: D14.2(C) D24.2(C) R22.1 R67.1 U9.6(LO)
NetD22_1: D22.1(A) R15.1
NetD23_1: D23.1(A) R18.1
NetD24_1: D24.1(A) R21.1
NetD25_1: D25.1(A) R24.1
NetD26_1: D26.1(A) R29.1
NetD60_1: D60.1(A) R180.1

Not connected (* = marked no-connect by the designer): U5 1 2 3 4 5; U7 8(NC)* 9(NC)* 10(NC)* 14(NC)*; U8 8(NC)* 9(NC)* 10(NC)* 14(NC)*; U9 8(NC)* 9(NC)* 10(NC)* 14(NC)*

### Notes on the sheet
- (near D25) Firstly , these Gate Drive ICs must be so close to the mosfets gate pins. In addition , it necessary to have the same layout width of pins that named HO and LO. Secondly , the decoupling caps should place the nearest empty place.
- Here is the another note to embedded software developers. There is no isolation protection. In this case , the most significant thing is the high side gate signals that given to the drivers. Please test the signal before use it in real life.
- THIS DOCUMENT AND THE DATA DISCLOSED HEREIN OR
- HEREWITH IS THE PROPERTY OF IRRESISTIBLE FUTURE AND MAY
- DWG NO:
- REVISION
- REV:
- DESCRIPTION
- DATE
- APPROVED
- BE FREELY DISTRIBUTED IN WHOLE. NO RIGHTS ARE
- RESERVED OR EXPRESS OR IMPLIED WARANTEE GIVEN.
- PROJECT
- Drawn by
- TITLE
- SCALE:
- A3
- SIZE
- Checked by
- FILE NAME
- SHEET
- OF
- 1:1
- 10
- (in symbol TLP152(TPL,E) Anode; Vcc; Vo; Cathode; Gnd

### Library data of the parts
C24 C26 C28 C29 C36 C38 = C0603C104K5RAC7411: CAP CER 0.1UF 50V X7R 0603; manufacturer: KEMET; Tolerance: ±10%; Part Number: C0603C104K5RAC7411; Value: 0.1 µF; Applications: Bypass, Decoupling; Capacitance: 0.1 µF; componentlink1description: Datasheet; componentlink1url: https://api.kemet.com/component-edge/download/datasheet/C0603C104K5RAC7411.pdf; componentlink2description: DigiKey Link; componentlink2url: https://www.digikey.com/en/products/detail/kemet/C0603C104K5RAC7411/3317013; Device Package: 0603 (1608 Metric); lastupdated: 11.07.2022 14:43:54; Lifecycle Status: Active; Minimum Order: 15000; Mounting Type: Surface Mount, MLCC; Operating Temperature: -55°C ~ 125°C; Package / Case: 0603 (1608 Metric); packaging: TapeAndReel; partid: 2233; Part Status: Active; price: 0.01; series: SMD Comm X7R; Size / Dimension: 0.063" L x 0.031" W (1.60mm x 0.80mm); Supplier 1: DigiKey; Supplier Part Number 1: 399-7374-2-ND; Temperature Coefficient: X7R; Thickness (Max): 0.035" (0.90mm); Voltage - Rated: 50V
C25 C27 C30 C31 C37 C39 = 06031C221KAT2A: CAP CER 220PF 100V X7R 0603; manufacturer: AVX Corporation; Tolerance: ±10%; Part Number: 06031C221KAT2A; Value: 220pF; Applications: General Purpose; Capacitance: 220pF; componentlink1description: Datasheet; componentlink1url: http://datasheets.avx.com/X7RDielectric.pdf; componentlink2description: DigiKey Link; componentlink2url: http://digikey.com/product-detail/en/avx-corporation/06031C221KAT2A/478-1195-1-ND/564227; Device Package: 0603 (1608 Metric); lastupdated: 2.09.2020 01:03:35; Lifecycle Status: Active; Minimum Order: 1; Mounting Type: Surface Mount, MLCC; Operating Temperature: -55°C ~ 125°C; Package / Case: 0603 (1608 Metric); packaging: TapeAndReel; partid: 2841; Part Status: Active; price: 0.02; series: -; Size / Dimension: 0.063" L x 0.032" W (1.60mm x 0.81mm); Supplier 1: DigiKey; Supplier Part Number 1: 478-1195-1-ND; Temperature Coefficient: X7R; Thickness (Max): 0.035" (0.90mm); Voltage - Rated: 100V
C32-C35 C40 C41 = C0603C105K4RACAUTO: as C45 on sheet IR_COMMUNICATION; Part Number: C0603C105K4RACAUTO; Value: 1 µF; Applications: Automotive, Bypass, Decoupling; Capacitance: 1 µF; componentlink1description: Datasheet; componentlink1url: https://api.kemet.com/component-edge/download/datasheet/C0603C105K4RACAUTO.pdf; componentlink2description: DigiKey Link; componentlink2url: https://www.digikey.com/en/products/detail/kemet/C0603C105K4RACAUTO/8635831; Device Package: 0603 (1608 Metric); lastupdated: 11.07.2022 14:43:54; Lifecycle Status: Active; Minimum Order: 1; Mounting Type: Surface Mount, MLCC; Operating Temperature: -55°C ~ 125°C; Package / Case: 0603 (1608 Metric); packaging: TapeAndReel; partid: 2179; Part Status: Active; price: 0.01; Ratings: AEC-Q200; series: SMD Auto X7R; Size / Dimension: 0.063" L x 0.031" W (1.60mm x 0.80mm); Supplier 1: DigiKey; Supplier Part Number 1: 399-17704-1-ND; Temperature Coefficient: X7R; Thickness (Max): 0.037" (0.95mm); Voltage - Rated: 16V
D6 D7 D12 = CMP-2000-07364-1: Ultra-Fast Rectifier, 1 A, 1.7 V, -65 to 150 degC, 2-Pin SMA, RoHS, Tape and Reel; Manufacturer: Diodes Inc; Forward Voltage: 1.7V; Reverse Recovery Time-Max: 75ns; Average Rectified Current-Max: 1A; Reverse Current-Max: 5µA; Reverse Voltage-Max [Vrrm]: 1000V; Package Description: 2-Pin Surface Mount Device, Body 4.3 x 2.605 mm; Datasheet URL: http://www.diodes.com/_files/datasheets/ds16008.pdf; Datasheet Version: Rev. 11-2, 12/2014; Package Reference: SMA-2; Mounting Technology: SurfaceMount; Manufacturer URL: http://www.diodes.com/
D8-D11 D13 D14 D22-D26 D60 = CMP-2000-04943-2: DIODE SCHOTTKY 40V 1A SMA; Manufacturer: ON Semiconductor; Peak Reverse Current: 0.2mA; Max Junction Temp: +125°C; Standoff Height: 0.05mm; Max Surge Forward Current: 40A; Mouser Description: Schottky Diodes & Rectifiers SMA 40V 1.0A; RoHS: TRUE; Lead Free: Yes; Manufacturer Part Number: SS14; Device Class L3: Schottky Diodes; Category: Diode; Automotive: No; Digikey Description: DIODE SCHOTTKY 40V 1A SMA; ComponentLink2Description: Datasheet; Device Class L2: Diodes; Height: 2.5mm; Temperature Range High: +125°C; ComponentLink2URL: https://www.onsemi.com/pub/Collateral/SS19-D.PDF; Device Class L1: Discrete Semiconductors; Package: 403AE; Octopart: https://octopart.com/ss14-on+semiconductor-29205033; Max Repetitive Reverse Voltage: 40V; Temperature Range Low: -65°C; Forward Current: 1A; Temperature: -65°C to +125°C
R13 R17 R20 R23 R26 R31 R49 R50 R57 R58 R64 R68 = RNCS0603BKE10K0: as R78 on sheet IR_COMMUNICATION; Part Number: RNCS0603BKE10K0; Value: 10 kOhms; ComponentLink1Description: Datasheet; ComponentLink1URL: https://www.seielect.com/catalog/sei-rncs_rnch.pdf; ComponentLink2Description: DigiKey Link; ComponentLink2URL: https://www.digikey.com/en/products/detail/stackpole-electronics-inc/RNCS0603BKE10K0/1708836; Composition: Thin Film; Device Package: 0603 (1608 Metric); Features: Anti-Corrosive, Automotive AEC-Q200, Moisture Resistant; Height - Seated (Max): 0.022" (0.55mm); LastUpdated: 11.07.2022 15:05:17; Lifecycle Status: Active; Minimum Order: 1; Number of Terminations: 2; Operating Temperature: -55°C ~ 155°C; Package / Case: 0603 (1608 Metric); Packaging: TapeAndReel; PartId: 4838; Part Status: Active; Price: 0.08; Ratings: AEC-Q200; Resistance: 10 kOhms; Series: RNCS; Size / Dimension: 0.061" L x 0.031" W (1.55mm x 0.80mm); Supplier 1: DigiKey; Supplier Part Number 1: RNCS0603BKE10K0CT-ND; Supplier Device Package: 0603; Tolerance: ±0.1%
R15 R18 R21 R24 R29 R45 R46 R52 R54 R62 R66 R180 = SDR03EZPF5R10: HIGH ANTI-SURGE THICK FILM CHIP; Manufacturer: Rohm Semiconductor; Power (Watts): 0.3W; Temperature Coefficient: ±200ppm/°C; Tolerance: ±1%; Part Number: SDR03EZPF5R10; Value: 5.1 Ohms; ComponentLink1Description: Datasheet; ComponentLink1URL: https://fscdn.rohm.com/en/products/databook/datasheet/passive/resistor/chip_resistor/sdr-e.pdf; ComponentLink2Description: DigiKey Link; ComponentLink2URL: https://www.digikey.com/en/products/detail/rohm-semiconductor/SDR03EZPF5R10/16180067; Composition: Thick Film; Device Package: 0603 (1608 Metric); Features: Automotive AEC-Q200, Pulse Withstanding; Height - Seated (Max): 0.022" (0.55mm); LastUpdated: 11.07.2022 15:03:16; Lifecycle Status: Active; Minimum Order: 1; Number of Terminations: 2; Operating Temperature: -55°C ~ 155°C; Package / Case: 0603 (1608 Metric); Packaging: TapeAndReel; PartId: 68447; Part Status: Active; Price: 0.01; Ratings: AEC-Q200; Resistance: 5.1 Ohms; Series: SDR; Size / Dimension: 0.063" L x 0.031" W (1.60mm x 0.80mm); Supplier 1: DigiKey; Supplier Part Number 1: 511-SDR03EZPF5R10CT-ND; Supplier Device Package: 0603
R16 R19 R22 R25 R30 R47 R48 R55 R56 R63 R67 R182 = CRT0603-BY-10R0ELF: RES SMD 10 OHM 0.1% 1/10W 0603; Manufacturer: Bourns Inc.; Power (Watts): 0.1W, 1/10W; Temperature Coefficient: ±25ppm/°C; Part Number: CRT0603-BY-10R0ELF; Value: 10 Ohms; ComponentLink1Description: Datasheet; ComponentLink1URL: https://www.bourns.com/docs/Product-Datasheets/crt.pdf; ComponentLink2Description: DigiKey Link; ComponentLink2URL: https://www.digikey.com/en/products/detail/bourns-inc/CRT0603-BY-10R0ELF/1775018; Composition: Thin Film; Device Package: 0603 (1608 Metric); Features: Current Sense; Height - Seated (Max): 0.024" (0.60mm); LastUpdated: 11.07.2022 15:05:17; Lifecycle Status: Active; Minimum Order: 1; Number of Terminations: 2; Operating Temperature: -55°C ~ 155°C; Package / Case: 0603 (1608 Metric); Packaging: TapeAndReel; PartId: 4866; Part Status: Active; Price: 0.04; Resistance: 10 Ohms; Series: CRT; Size / Dimension: 0.061" L x 0.031" W (1.55mm x 0.80mm); Supplier 1: DigiKey; Supplier Part Number 1: CRT0603-BY-10R0ELFCT-ND; Supplier Device Package: 0603; Tolerance: ±0.1%
R39 R41 R59 = CPF0603B3R32E1: CPF 0603 3R32 0.1% 25PPM 1K RL; Manufacturer: TE Connectivity Passive Product; Power (Watts): 0.063W, 1/16W; Temperature Coefficient: ±25ppm/°C; Part Number: CPF0603B3R32E1; Value: 3.32 Ohms; ComponentLink1Description: Datasheet; ComponentLink1URL: https://www.te.com/commerce/DocumentDelivery/DDEController?Action=srchrtrv&DocNm=1773200&DocType=DS&DocLang=English; ComponentLink2Description: DigiKey Link; ComponentLink2URL: https://www.digikey.com/en/products/detail/te-connectivity-passive-product/CPF0603B3R32E1/14007032; Composition: Thin Film; Device Package: 0603 (1608 Metric); Height - Seated (Max): 0.022" (0.55mm); LastUpdated: 11.07.2022 15:03:42; Lifecycle Status: Active; Minimum Order: 1; Number of Terminations: 2; Operating Temperature: -55°C ~ 155°C; Package / Case: 0603 (1608 Metric); Packaging: TapeAndReel; PartId: 64124; Part Status: Active; Price: 0.13; Resistance: 3.32 Ohms; Series: CPF; Size / Dimension: 0.061" L x 0.031" W (1.55mm x 0.80mm); Supplier 1: DigiKey; Supplier Part Number 1: 1712-CPF0603B3R32E1CT-ND; Supplier Device Package: 0603; Tolerance: ±0.1%
R40 R42-R44 R60 R61 = CRCW060351R0JNEA: RES SMD 51 OHM 5% 1/10W 0603; Manufacturer: Vishay Dale; Power (Watts): 0.1W, 1/10W; Temperature Coefficient: ±200ppm/°C; Part Number: CRCW060351R0JNEA; Value: 51 Ohms; ComponentLink1Description: Datasheet; ComponentLink1URL: http://www.vishay.com/docs/20035/dcrcwe3.pdf; ComponentLink2Description: DigiKey Link; ComponentLink2URL: https://www.digikey.com/en/products/detail/vishay-dale/CRCW060351R0JNEA/1174198; Composition: Thick Film; Device Package: 0603 (1608 Metric); Features: Automotive AEC-Q200; Height - Seated (Max): 0.020" (0.50mm); LastUpdated: 11.07.2022 15:05:16; Lifecycle Status: Active; Minimum Order: 1; Number of Terminations: 2; Operating Temperature: -55°C ~ 155°C; Package / Case: 0603 (1608 Metric); Packaging: CutTape; PartId: 5142; Part Status: Active; Price: 0.01; Ratings: AEC-Q200; Resistance: 51 Ohms; Series: CRCW; Size / Dimension: 0.063" L x 0.033" W (1.60mm x 0.85mm); Supplier 1: DigiKey; Supplier Part Number 1: 541-51GCT-ND; Supplier Device Package: 0603; Tolerance: ±5%
R51 R53 R65 = CPF-A-0603B15RE: RES SMD 15 OHM 0.1% 1/16W 0603; Manufacturer: TE Connectivity Passive Product; Power (Watts): 0.063W, 1/16W; Temperature Coefficient: ±25ppm/°C; Part Number: CPF-A-0603B15RE; Value: 15 Ohms; ComponentLink1Description: Datasheet; ComponentLink1URL: https://www.te.com/commerce/DocumentDelivery/DDEController?Action=srchrtrv&DocNm=1773200-1&DocType=DS&DocLang=English; ComponentLink2Description: DigiKey Link; ComponentLink2URL: https://www.digikey.com/en/products/detail/te-connectivity-passive-product/CPF-A-0603B15RE/5583800; Composition: Thin Film; Device Package: 0603 (1608 Metric); Features: Anti-Sulfur, Automotive AEC-Q200, Moisture Resistant; Height - Seated (Max): 0.022" (0.55mm); LastUpdated: 11.07.2022 15:05:17; Lifecycle Status: Active; Minimum Order: 1; Number of Terminations: 2; Operating Temperature: -55°C ~ 155°C; Package / Case: 0603 (1608 Metric); Packaging: TapeAndReel; PartId: 4890; Part Status: Active; Price: 0.10; Ratings: AEC-Q200; Resistance: 15 Ohms; Series: CPF-A, Neohm; Size / Dimension: 0.061" L x 0.031" W (1.55mm x 0.80mm); Supplier 1: DigiKey; Supplier Part Number 1: 1712-CPF-A-0603B15RECT-ND; Supplier Device Package: 0603; Tolerance: ±0.1%
U5 = TLP152(TPL,E: OPTOISO 3.75KV GATE DRIVER 6SO-5; Manufacturer: Toshiba; Number of Channels: 1; Propagation Delay: 165ns; Max Power Dissipation: 260mW; Direction: Unidirectional; Turn-On Delay Time: 190ns; Fall Time: 22ns; Forward Voltage: 1.57V; Output Current: 2.5A; Forward Current: 10mA; Rise Time: 18ns; High Level Output Current: 2A; Pulse Width Distortion (PWD): 50ns; ComponentLink1URL: https://datasheet.ciiva.com/41848/tlp152-datasheet-en-20120914-41848928.pdf?src-supplier=Digi-Key; ComponentLink1Description: https://datasheet.ciiva.com/41848/tlp152-datasheet-en-20120914-41848928.pdf?src-supplier=Digi-Key; Supplier 1: Mouser; Manufacturer Part Number: TLP152(TPL,E; RoHS: Yes; Stock 1: 22321; Pricing 1: 1 = 1.55000, 10 = 0.96800, 50 = 0.96800, 100 = 0.87200, 1000 = 0.54300, 10000 = 0.44000 (USD); Mount: Surface Mount; Case/Package: SO; Number of Pins: 5; Min Operating Temperature: -40°C; Max Operating Temperature: 100°C; Packaging: Tape and Reel; Package Quantity: 3000; Low Level Output Current: 2A; Max Output Current: 2.5A; Supplier Part Number 1: 757-TLP152TPLE
U7-U9 = UCC27714D14: High-Speed Low-side Gate Driver Device, D0014A; Alternate Manufacturer: None; Manufacturer: Texas Instruments; SymbolCreator: a0411947; CompType: IC; U/M: EA; SymbolVersion: 2013-03-13; PartNumber: UCC27714D14; PackageReference: D0014A; MountType: SMT; ComponentLink1Description: Datasheet Link; ComponentLink1URL: https://sps06.itg.ti.com/sites/KMS/crossdivteams/altium/docs/ComponentDatasheets/UCC27714 Data Sheet Preliminary 3 12 2013.pdf; RoHS: Y; Publisher: Texas Instruments; LatestRevisionDate: 2014-07-15

## Sheet IR_INVERTER.SchDoc: IR_INVERTER
size 420 x 297 mm; Engineer: ALPER KORKMAZ; SheetNumber: 4; SheetTotal: 8; SHEET: 4
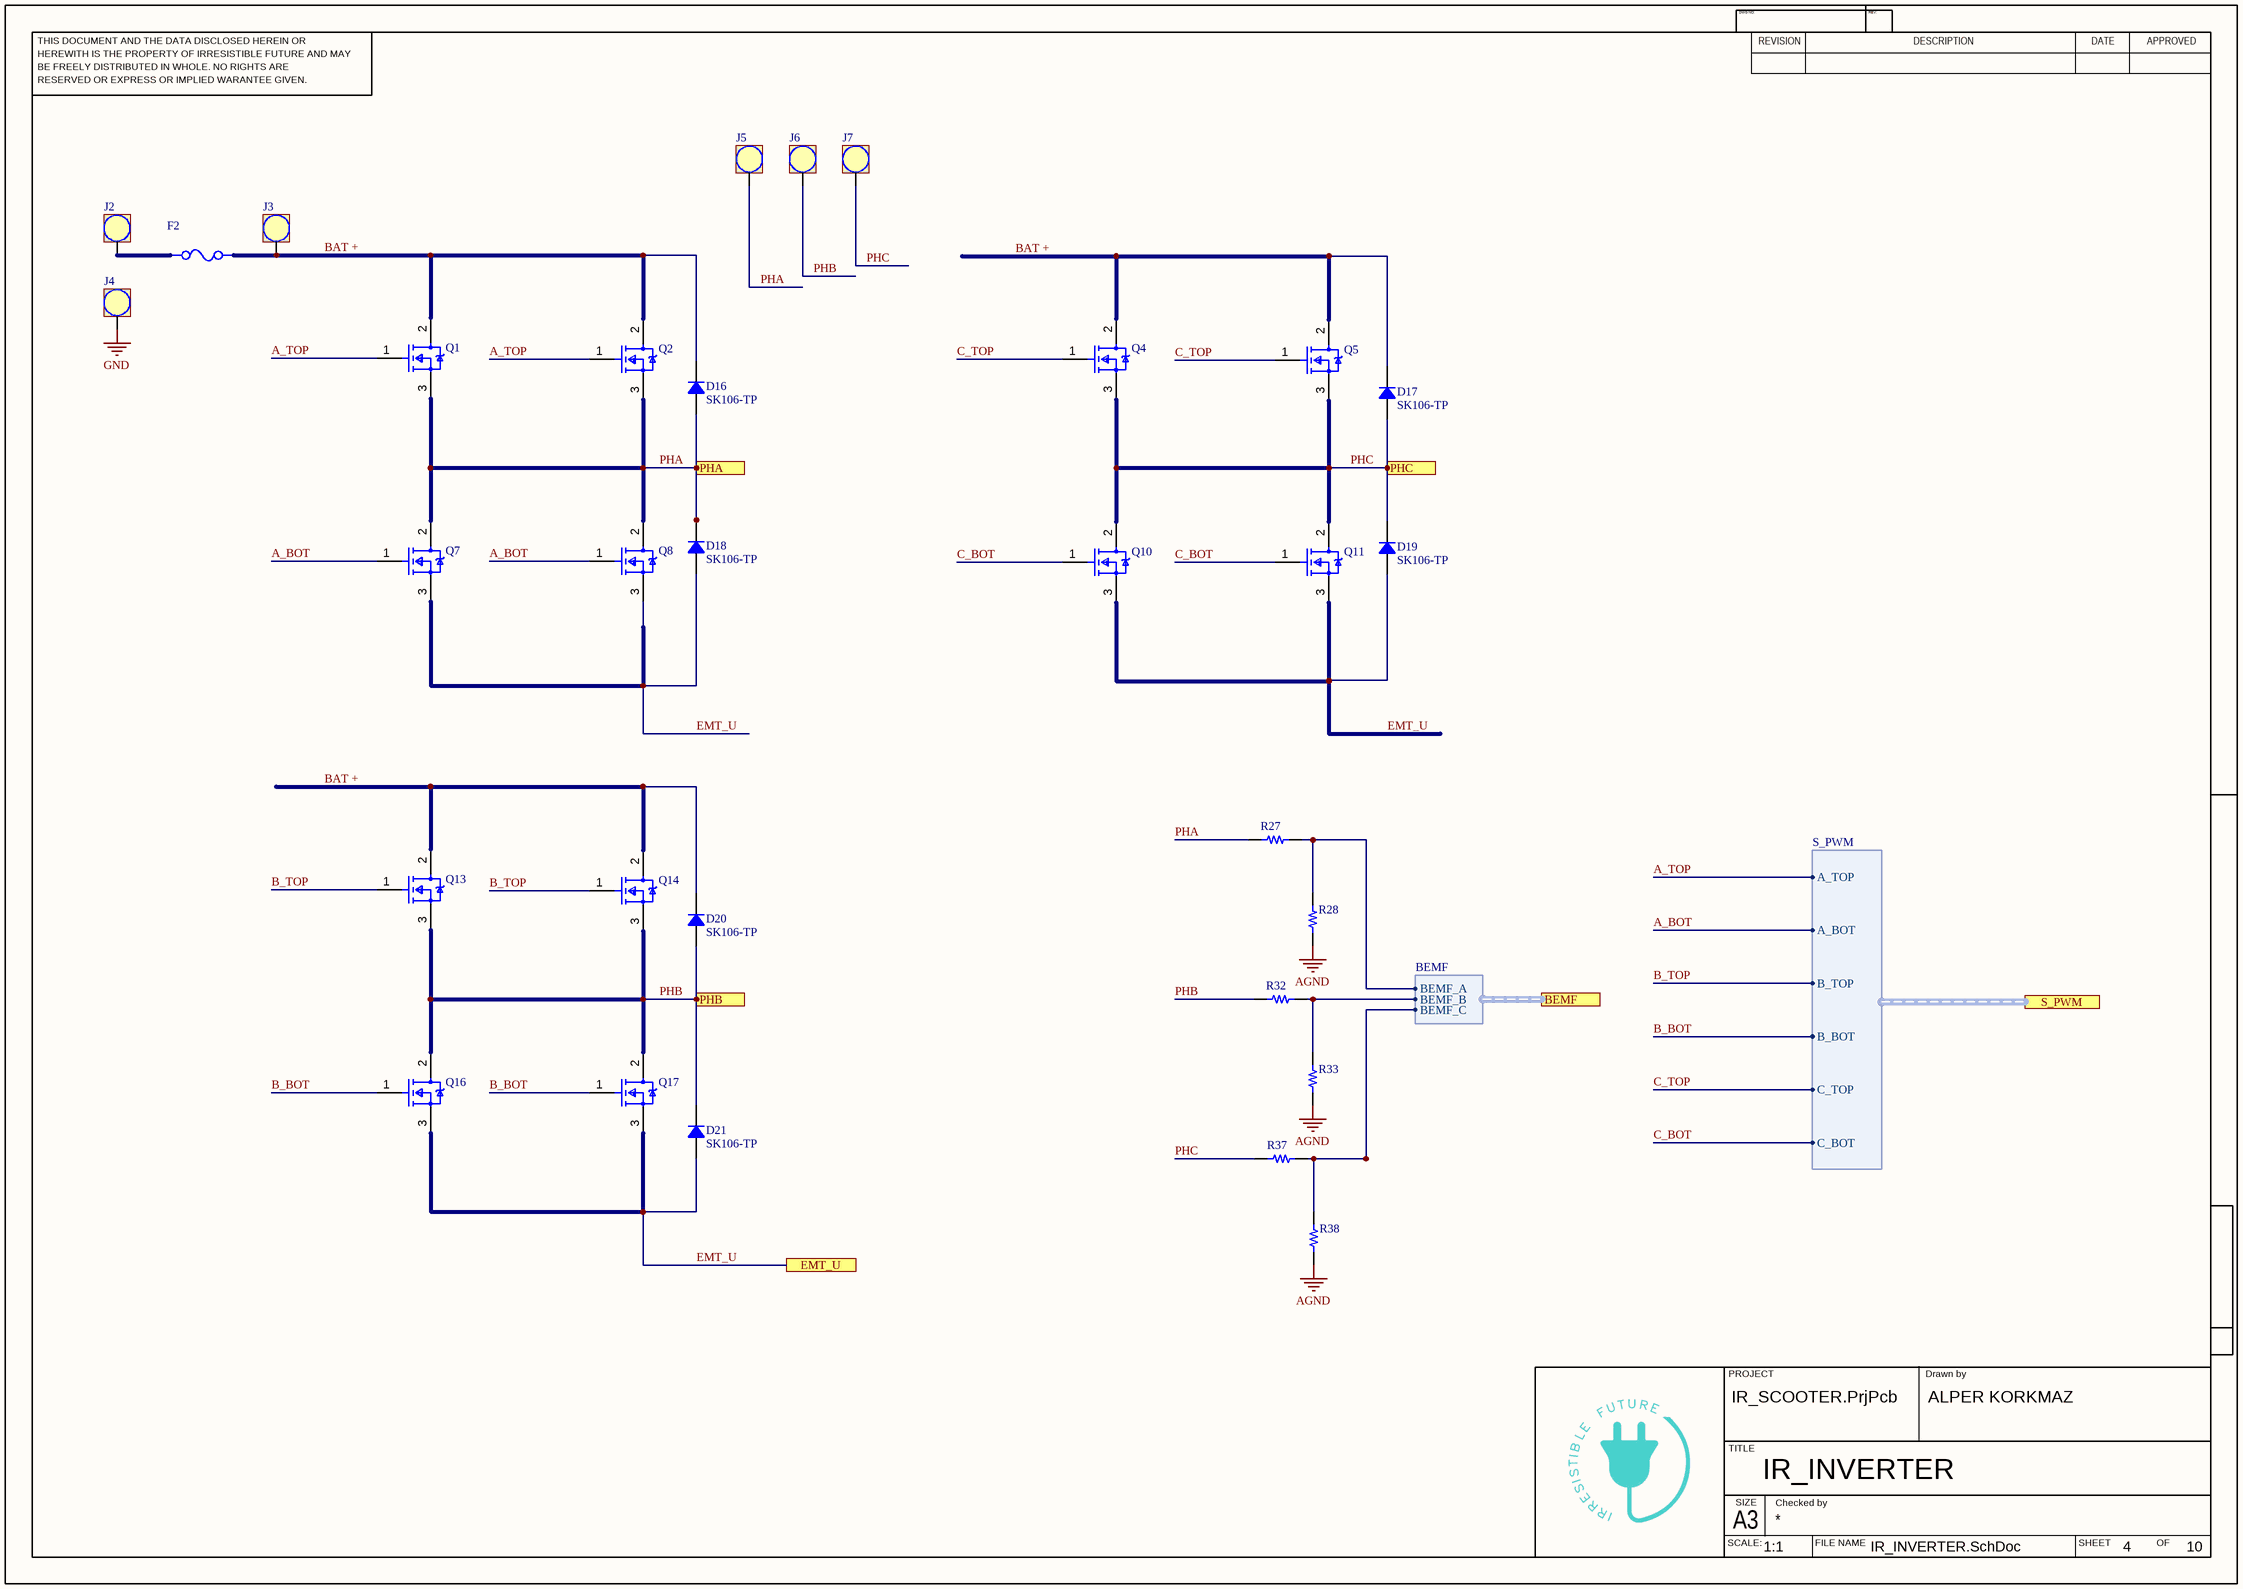
[diagram p7: IR_INVERTER.SchDoc]

### Parts
(Parts that share a designator on the sheet are numbered #1, #2 ... from top to bottom, then left to right.)
D16  SK106-TP  [DO214AB SMC]
D17  SK106-TP  [DO214AB SMC]
D18  SK106-TP  [DO214AB SMC]
D19  SK106-TP  [DO214AB SMC]
D20  SK106-TP  [DO214AB SMC]
D21  SK106-TP  [DO214AB SMC]
F2  0498040.M  [FP-0498-MFG]  (value not drawn)
J2  M5 Bush  [7460408_HAL Surface]  (value not drawn)
J3  M5 Bush  [7460408_HAL Surface]  (value not drawn)
J4#2  M5 Bush  [7460408_HAL Surface]  (value not drawn)
J5#2  M5 Bush  [7460408_HAL Surface]  (value not drawn)
J6  M5 Bush  [7460408_HAL Surface]  (value not drawn)
J7  M5 Bush  [7460408_HAL Surface]  (value not drawn)
Q1  IRF3205STRLPBF  [FP-PG-TO263-3-MFG]  (value not drawn)
Q2  IRF3205STRLPBF  [FP-PG-TO263-3-MFG]  (value not drawn)
Q4  IRF3205STRLPBF  [FP-PG-TO263-3-MFG]  (value not drawn)
Q5  IRF3205STRLPBF  [FP-PG-TO263-3-MFG]  (value not drawn)
Q7  IRF3205STRLPBF  [FP-PG-TO263-3-MFG]  (value not drawn)
Q8  IRF3205STRLPBF  [FP-PG-TO263-3-MFG]  (value not drawn)
Q10  IRF3205STRLPBF  [FP-PG-TO263-3-MFG]  (value not drawn)
Q11  IRF3205STRLPBF  [FP-PG-TO263-3-MFG]  (value not drawn)
Q13  IRF3205STRLPBF  [FP-PG-TO263-3-MFG]  (value not drawn)
Q14  IRF3205STRLPBF  [FP-PG-TO263-3-MFG]  (value not drawn)
Q16  IRF3205STRLPBF  [FP-PG-TO263-3-MFG]  (value not drawn)
Q17  IRF3205STRLPBF  [FP-PG-TO263-3-MFG]  (value not drawn)
R27  7k Ohms  [RES 0603_1608]  (value not drawn)
R28  2k Ohms  [RES 0603_1608]  (value not drawn)
R32  7k Ohms  [RES 0603_1608]  (value not drawn)
R33  2k Ohms  [RES 0603_1608]  (value not drawn)
R37  7k Ohms  [RES 0603_1608]  (value not drawn)
R38  2k Ohms  [RES 0603_1608]  (value not drawn)

### Ports
BEMF (harness BEMF, see 1[5A], 3[5B]), EMT_U (see 1[4A], 5[3B]), PHA (see 1[4A], 5[3B]), PHB (see 1[4A], 5[3C]), PHC (see 1[4A], 5[5B]), S_PWM (harness S_PWM, see 1[4A], 5[5C])

### Harnesses
BEMF: BEMF_A, BEMF_B, BEMF_C
S_PWM: A_TOP, A_BOT, B_TOP, B_BOT, C_TOP, C_BOT

### Nets
AGND: R28.1 R33.1 R38.1
GND: J4#2.1
A_BOT: Q7.1(G) Q8.1(G) ; port S_PWM.A_BOT
A_TOP: Q1.1(G) Q2.1(G) ; port S_PWM.A_TOP
B_BOT: Q16.1(G) Q17.1(G) ; port S_PWM.B_BOT
B_TOP: Q13.1(G) Q14.1(G) ; port S_PWM.B_TOP
BAT +: D16.2 D17.2 D20.2 J3.1 Q1.2(D) Q2.2(D) Q4.2(D) Q5.2(D) Q13.2(D) Q14.2(D)
C_BOT: Q10.1(G) Q11.1(G) ; port S_PWM.C_BOT
C_TOP: Q4.1(G) Q5.1(G) ; port S_PWM.C_TOP
EMT_U: D18.1 D19.1 D21.1 Q7.3(S) Q8.3(S) Q10.3(S) Q11.3(S) Q16.3(S) Q17.3(S) ; port EMT_U
PHA: D16.1 D18.2 J5#2.1 Q1.3(S) Q2.3(S) Q7.2(D) Q8.2(D) R27.1 ; port PHA
PHB: D20.1 D21.2 J6.1 Q13.3(S) Q14.3(S) Q16.2(D) Q17.2(D) R32.1 ; port PHB
PHC: D17.1 D19.2 J7.1 Q4.3(S) Q5.3(S) Q10.2(D) Q11.2(D) R37.1 ; port PHC
NetR27_2: R27.2 R28.2 ; port BEMF.BEMF_A
NetR32_2: R32.2 R33.2 ; port BEMF.BEMF_B
NetR37_2: R37.2 R38.2 ; port BEMF.BEMF_C

Not connected (* = marked no-connect by the designer): J2 1

### Notes on the sheet
- THIS DOCUMENT AND THE DATA DISCLOSED HEREIN OR
- HEREWITH IS THE PROPERTY OF IRRESISTIBLE FUTURE AND MAY
- DWG NO:
- REVISION
- REV:
- DESCRIPTION
- DATE
- APPROVED
- BE FREELY DISTRIBUTED IN WHOLE. NO RIGHTS ARE
- RESERVED OR EXPRESS OR IMPLIED WARANTEE GIVEN.
- PROJECT
- Drawn by
- TITLE
- SCALE:
- A3
- SIZE
- Checked by
- FILE NAME
- SHEET
- OF
- 1:1
- 10

### Library data of the parts
D16-D21 = SK106-TP: DIODE SCHOTTKY 60V 10A DO214AB; Manufacturer: Micro Commercial Co; Capacitance @ Vr, F: 500pF @ 4V, 1MHz; Current - Reverse Leakage @ Vr: 1mA @ 60V; Speed: Fast Recovery =< 500ns, > 200mA (Io); Voltage - Forward (Vf) (Max) @ If: 850mV @ 10A; Part Number: SK106-TP; ComponentLink1Description: Datasheet; ComponentLink1URL: https://www.mccsemi.com/pdf/Products/SK102-SK1010(HSMC).PDF; ComponentLink2Description: DigiKey Link; ComponentLink2URL: http://digikey.com/product-detail/en/micro-commercial-co/SK106-TP/SK106-TPTR-ND/1306162; Current - Average Rectified (Io): 10A; Diode Type: Schottky; LastUpdated: 21.07.2022 04:40:05; Lifecycle Status: Active; Minimum Order: 0; Mounting Type: Surface Mount; Operating Temperature - Junction: -55°C ~ 125°C; Package / Case: DO-214AB, SMC; Packaging: TapeAndReel; PartId: 1760; Part Status: Active; Price: 0.29; Series: -; Supplier 1: DigiKey; Supplier Part Number 1: SK106-TPTR-ND; Supplier Device Package: DO-214AB (HSMC); Voltage - DC Reverse (Vr) (Max): 60V
F2 = CMP-08605-000064-1: FUSE AUTO 40A 32VDC AUTO LINK; Manufacturer: Littelfuse Inc; Resistance: 1.398mΩ; Voltage Rating: 32V; Fuse Interrupt Dc Current: 1000A; Fuse I2T: 10000A2Sec; Value: 1.398mΩ; Fuse Voltage Drop: 65mV; Fuse Blow Speed: Slow; Height: 8mm; Package: 0498; Octopart: https://octopart.com/0498040.m-littelfuse-561198; ComponentLink2Description: Datasheet; Temperature: -40°C to +125°C; Lead Free: Yes; Device Class L1: Circuit Protection; Device Class L2: Fuses; RoHS: TRUE; Max Fuse Dc Voltage: 32V; Mouser Description: Automotive Fuses 32V 40A; ComponentLink2URL: https://www.littelfuse.com/~/media/automotive/datasheets/fuses/passenger-car-and-commercial-vehicle/bolt-down-fuses/littelfuse_midi_datasheet.pdf; Category: Fuse; Fuse Current: 40A; Device Class L3: unset; Temperature Range High: +125°C; Temperature Range Low: -40°C; Automotive: Yes; Manufacturer Part Number: 0498040.M; Digikey Description: FUSE AUTO 40A 32VDC AUTO LINK
J2 J3 J4#2 J5#2 J6 J7 = 7460408: Bush with Circumference M5; Brand: Wurth; Case Style: M5Bush; Brand Number: 7460408; Order Code Supplier: 1821279; Price: 4,17; Supplier: Farnell
Q1 Q2 Q4 Q5 Q7 Q8 Q10 Q11 Q13 Q14 Q16 Q17 = CMP-32901-000011-1: MOSFET N-CH 55V 110A D2PAK; Manufacturer: Infineon Technologies; Threshold Vgs Min: 2V; Turn Off Delay Time: 50ns; Pulse Drain Current: 390A; Max Forward Diode Voltage: 1.3V; Number Of Channels: 1; Threshold Vgs Max: 4V; Gate To Source Voltage: 20V; Input Capacitace At Vds: 3247pF @ 25V; Depletion Mode: False; Reverse Recovery Time: 69ns; Standoff Height: 0mm; Turn On Delay Time: 14ns; Gate Charge At Vgs: 146nC @ 10V; Drain To Source Resistance: 8mΩ; Rthja Max: 40°C/W; Power Dissipation: 200W; Max Junction Temp: +175°C; Reverse Recovery Charge: 143nC; ComponentLink2Description: Datasheet; Temperature Range Low: -55°C; ComponentLink2URL: https://www.infineon.com/dgdl/irf3205spbf.pdf?fileId=5546d462533600a4015355defac9190c; Automotive: No; Height: 5.084mm; Lead Free: Yes; Device Class L1: Discrete Semiconductors; Drain To Source Voltage: 55V; Device Class L3: MOSFETs; Temperature: -55°C to +175°C; Drain To Source Breakdown Voltage: 55V; Manufacturer Part Number: IRF3205STRLPBF; Temperature Range High: +175°C; Device Class L2: Transistors; Octopart: https://octopart.com/irf3205strlpbf-infineon-65873335; Digikey Description: MOSFET N-CH 55V 110A D2PAK; RoHS: TRUE; Number Of N Channels: 1; Continuous Drain Current: 110A; Category: Trans; Package: PG-TO263-3
R27 R28 R32 R33 R37 R38 = RNCS0603BKE10K0: RES 10K OHM 0.1% 1/16W 0603; Manufacturer: Stackpole Electronics Inc; Power (Watts): 0.063W, 1/16W; Resistance: 10 kOhms; Temperature Coefficient: ±25ppm/°C; Part Number: RNCS0603BKE10K0; ComponentLink1Description: Datasheet; ComponentLink1URL: https://www.seielect.com/catalog/sei-rncs_rnch.pdf; ComponentLink2Description: DigiKey Link; ComponentLink2URL: https://www.digikey.com/en/products/detail/stackpole-electronics-inc/RNCS0603BKE10K0/1708836; Composition: Thin Film; Device Package: 0603 (1608 Metric); Features: Anti-Corrosive, Automotive AEC-Q200, Moisture Resistant; Height - Seated (Max): 0.022" (0.55mm); LastUpdated: 23.05.2022 13:14:49; Lifecycle Status: Active; Minimum Order: 1; Number of Terminations: 2; Operating Temperature: -55°C ~ 155°C; Package / Case: 0603 (1608 Metric); Packaging: TapeAndReel; PartId: 4838; Part Status: Active; Price: 0.08; Ratings: AEC-Q200; Series: RNCS; Size / Dimension: 0.061" L x 0.031" W (1.55mm x 0.80mm); Supplier 1: DigiKey; Supplier Part Number 1: RNCS0603BKE10K0CT-ND; Supplier Device Package: 0603; Tolerance: ±0.1%
  R27 R32 R37: Value: 7k Ohms
  R28 R33 R38: Value: 2k Ohms